# EAGLE design FiltreFSK (EAGLE 6.4)
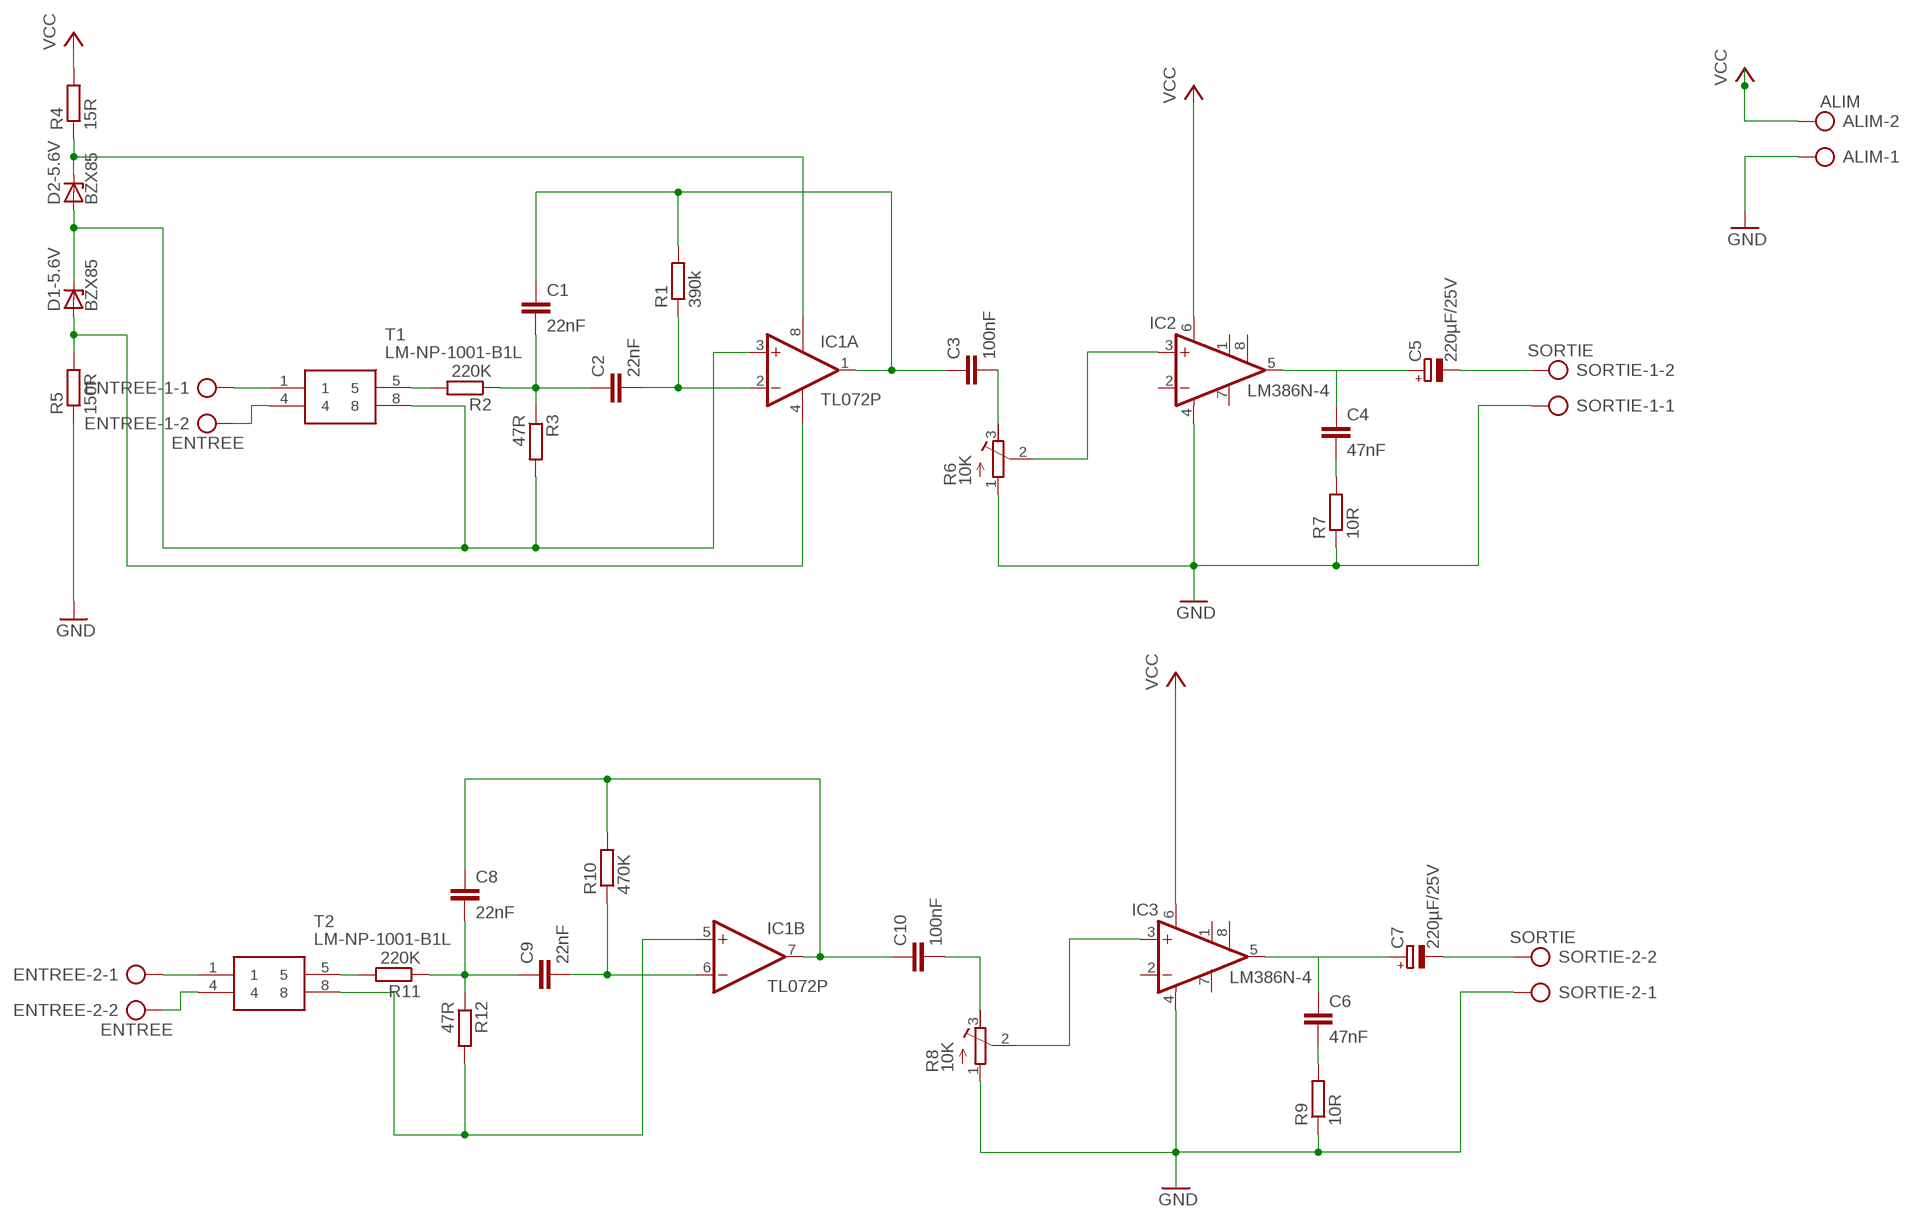
[diagram p0: schematic, sheet 1]

## Parts
ALIM  ALIM  AK500/2-H  [AK500/2-H]
C1  22nF  C-EU050-025X075  [C050-025X075]
C2  22nF  C-EU050-025X075  [C050-025X075]
C3  100nF  C-EU075-042X103  [C075-042X103]
C4  47nF  C-EU050-025X075  [C050-025X075]
C5  220µF/25V  CPOL-EUE3.5-8  [E3,5-8]
C6  47nF  C-EU050-025X075  [C050-025X075]
C7  220µF/25V  CPOL-EUE3.5-8  [E3,5-8]
C8  22nF  C-EU050-025X075  [C050-025X075]
C9  22nF  C-EU050-025X075  [C050-025X075]
C10  100nF  C-EU075-042X103  [C075-042X103]
D1-5.6V  BZX85  [DO41Z10]
D2-5.6V  BZX85  [DO41Z10]
ENTREE-1  ENTREE  AK500/2-H  [AK500/2-H]
ENTREE-2  ENTREE  AK500/2-H  [AK500/2-H]
IC1  TL072P  [DIL08]
IC2  LM386N-4  [DIL08]
IC3  LM386N-4  [DIL08]
R1  390k  R-EU_0207/10  [0207/10]
R2  220K  R-EU_0207/10  [0207/10]
R3  47R  R-EU_0207/10  [0207/10]
R4  15R  R-EU_0207/10  [0207/10]
R5  150R  R-EU_0207/10  [0207/10]
R6  10K  R-TRIMM3339P  [RTRIM3339P]
R7  10R  R-EU_0207/10  [0207/10]
R8  10K  R-TRIMM3339P  [RTRIM3339P]
R9  10R  R-EU_0207/10  [0207/10]
R10  470K  R-EU_0207/10  [0207/10]
R11  220K  R-EU_0207/10  [0207/10]
R12  47R  R-EU_0207/10  [0207/10]
SORTIE-1  SORTIE  AK500/2-H  [AK500/2-H]
SORTIE-2  SORTIE  AK500/2-H  [AK500/2-H]
T1  LM-NP-1001-B1L  [LMNP1001B1L]
T2  LM-NP-1001-B1L  [LMNP1001B1L]

## Nets
GND: ALIM.1 IC2.4(GND) IC3.4(GND) R5.1 R6.1(A) R7.1 R8.1(A) R9.1 SORTIE-1.1 SORTIE-2.1
N$1: D2-5.6V.C IC1.8(P:V+) R4.1
N$2: D1-5.6V.C D2-5.6V.A IC1.3(A:+IN) R3.2 T1.8
N$3: D1-5.6V.A IC1.4(P:V-) R5.2
N$4: C1.2 C2.1 R2.1 R3.1
N$5: C1.1 C3.1 IC1.1(A:OUT) R1.2
N$6: C2.2 IC1.2(A:-IN) R1.1
N$7: ENTREE-1.1 T1.1
N$8: IC2.3(+IN) R6.2(S)
N$9: C4.2 R7.2
N$10: C3.2 R6.3(E)
N$11: ENTREE-1.2 T1.4
N$12: C4.1 C5.+ IC2.5(OUT)
N$13: R2.2 T1.5
N$14: C5.- SORTIE-1.2
N$15: C10.2 R8.3(E)
N$16: IC3.3(+IN) R8.2(S)
N$17: C6.2 R9.2
N$18: C6.1 C7.+ IC3.5(OUT)
N$19: C7.- SORTIE-2.2
N$21: IC1.5(B:+IN) R12.2 T2.8
N$23: C8.2 C9.1 R11.1 R12.1
N$24: C8.1 C10.1 IC1.7(B:OUT) R10.2
N$25: C9.2 IC1.6(B:-IN) R10.1
N$26: ENTREE-2.1 T2.1
N$27: ENTREE-2.2 T2.4
N$28: R11.2 T2.5
VCC: ALIM.2 IC2.6(VS) IC3.6(VS) R4.2
Unconnected: IC2.1(GAIN) IC2.2(-IN) IC2.7(BYPASS) IC2.8(GAIN) IC3.1(GAIN) IC3.2(-IN) IC3.7(BYPASS) IC3.8(GAIN)

## Library data of the parts
ALIM ENTREE-1 ENTREE-2 SORTIE-1 SORTIE-2 = con-ptr500:AK500/2-H: CONNECTOR Aug. 2004 / PTR Meßtechnik: Die Bezeichnung der Serie AK505 wurde geändert. Es handelt sich hierbei um AK500 in horizontaler Ausführung.; OC_FARNELL: unknown; OC_NEWARK: unknown
C1-C4 C6 C8-C10 = rcl:C-EU: CAPACITOR, European symbol
C5 C7 = rcl:CPOL-EU: POLARIZED CAPACITOR, European symbol
D1-5.6V D2-5.6V = diode:BZX85: Z DIODE
IC1 = linear:TL072: OP AMP
IC2 IC3 = linear:LM386?-*: Low Voltage Audio Power Amplifier Source: http://cache.national.com/ds/LM/LM386.pdf
R1-R5 R7 R9-R12 = rcl:R-EU_: RESISTOR, European symbol
R6 R8 = rcl:R-TRIMM: Trimm resistor
T1 T2 = LM-NP-1001-B1L:LM-NP-1001-B1L: BOURNS - LM-NP-1001-B1L - TRANSFORMER, LINE-MATCHING 1:1, 2.8H Source: Datasheet <https://www.bourns.com/pdfs/LMNPLP.pdf>; ALLIED_NUMBER: 70154707; ALLIED_PRICE-STOCK: https://www.alliedelec.com/bourns-lm-np-1001-b1l/70154707/; DESCRIPTION: BOURNS - LM-NP-1001-B1L - TRANSFORMER, LINE-MATCHING 1:1, 2.8H; HEIGHT: 12mm; MANUFACTURER_NAME: Bourns; MANUFACTURER_PART_NUMBER: LM-NP-1001-B1L; MOUSER_PART_NUMBER: 652-LM-NP-1001-B1L; MOUSER_PRICE-STOCK: https://www.mouser.com/Search/Refine.aspx?Keyword=652-LM-NP-1001-B1L; RS_PART_NUMBER: 1740620; RS_PRICE-STOCK: http://uk.rs-online.com/web/p/products/1740620

## Board
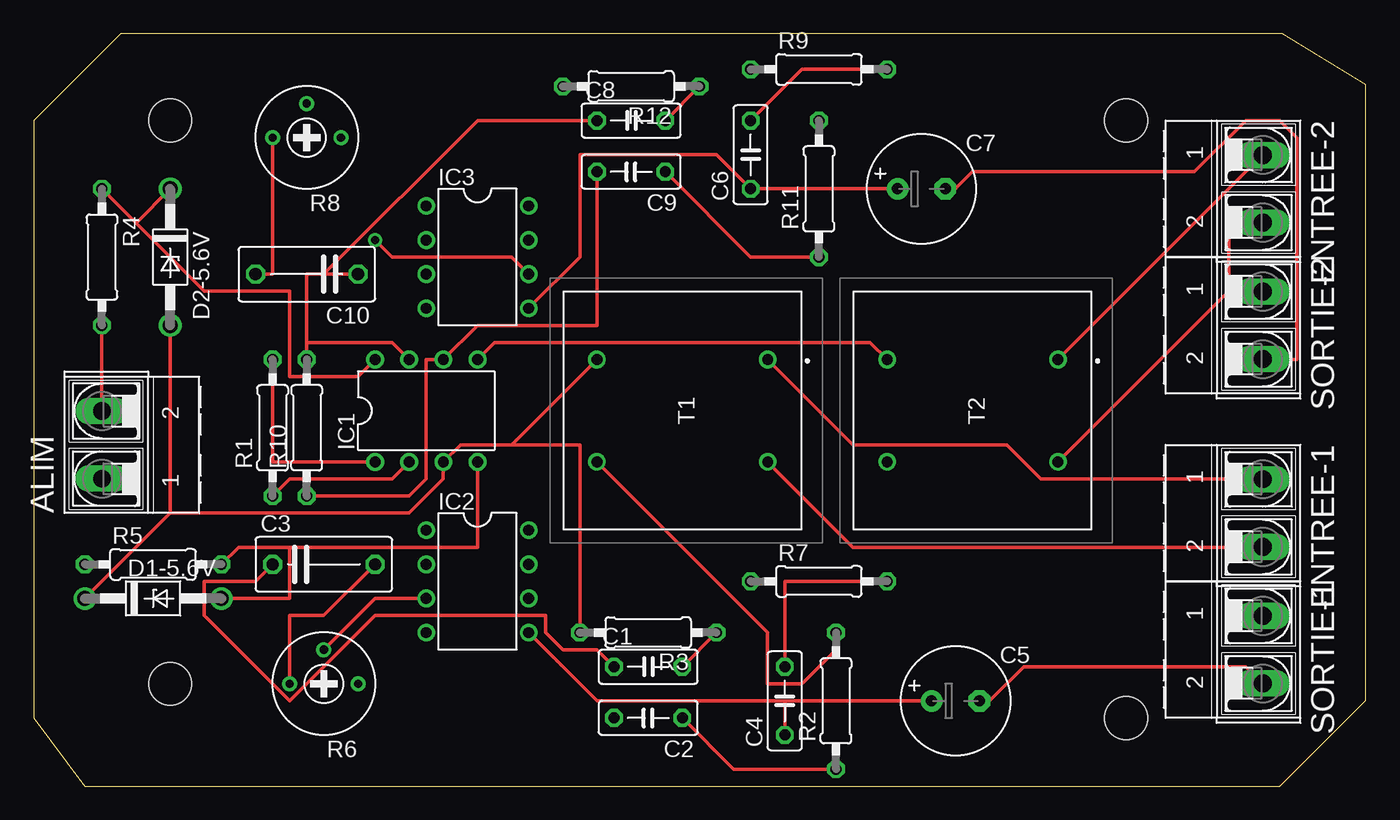
[diagram p1: board, top side]
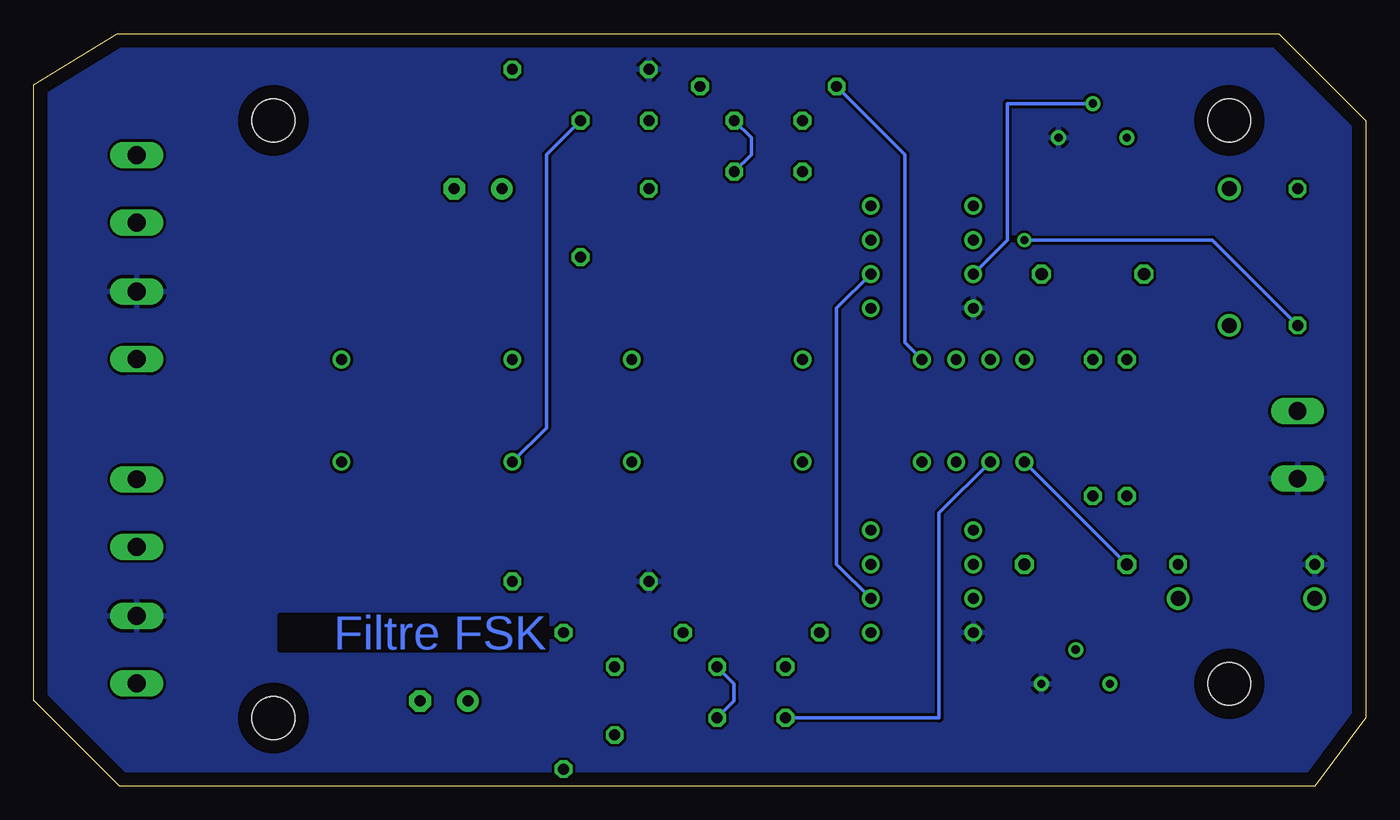
[diagram p2: board, bottom side, seen from below]

Size 99.11 x 56 mm. Coordinates in mm from the lower left corner, seen from the top.
Outline: 99.06,6.35 92.71,0 3.81,0 0,5.08 0,49.53 6.47,56 92.88,56 99.11,52.19 99.11,6.35
Copper layers (1*16): Top 0.035mm / dielectric 1.5mm / Bottom 0.035mm
Design rules "default": minimum track width 10mil, minimum drill 24mil, track to track 8mil, track to pad 8mil, pad to pad 8mil, via to via 8mil, smd to smd 8mil, copper to edge 40mil, drill to drill 8mil, minimum pad ring 10mil, minimum via ring 8mil, stop-mask expansion 4mil, vias tented up to drill 0mil, thermal gap 10mil
Holes 3.2 mm at 10.16,7.62 81.28,5.08 81.28,49.53 10.16,49.53

### Footprints (pad centres in the part's own frame; a part is rotated, then mirrored left to right if it is on the bottom)
AK500/2-H = drill 1.321 long: 1 -2.515,0; 2 2.515,0
C050-025X075 = drill 0.813 octagon: 1 -2.54,0; 2 2.54,0
C075-042X103 = drill 0.914 octagon: 1 -3.81,0; 2 3.81,0
E3,5-8 = drill 0.813 pad 1.6: + -1.778,0 | drill 0.813 pad 1.6 octagon: - 1.778,0
DO41Z10 = drill 1.118: A 5.08,0; C -5.08,0
DIL08 = drill 0.813 pad 1.27: 1 -3.81,-3.81; 2 -1.27,-3.81; 3 1.27,-3.81; 4 3.81,-3.81; 5 3.81,3.81; 6 1.27,3.81; 7 -1.27,3.81; 8 -3.81,3.81
0207/10 = drill 0.813 octagon: 1 -5.08,0; 2 5.08,0
RTRIM3339P = drill 0.61: 1 -2.54,0; 2 0,-2.54; 3 2.54,0
LMNP1001B1L = drill 0.8 pad 1.3: 1 3.81,-6.35; 4 -3.81,-6.35; 5 -3.81,6.35; 8 3.81,6.35

### Placement (x,y rotation side)
ALIM  5.08,25.4 90 top
C1  45.72,8.89 0 top
C2  45.72,5.08 180 top
C3  21.59,16.51 0 top
C4  55.88,6.35 90 top
C5  68.58,6.35 0 top
C6  53.34,46.99 90 top
C7  66.04,44.45 0 top
C8  44.45,49.53 0 top
C9  44.45,45.72 180 top
C10  20.32,38.1 180 top
D1-5.6V  8.89,13.97 0 top
D2-5.6V  10.16,39.37 270 top
ENTREE-1  91.44,20.32 270 top
ENTREE-2  91.44,44.45 270 top
IC1  29.21,27.94 0 top
IC2  33.02,15.24 270 top
IC3  33.02,39.37 270 top
R1  17.78,26.67 90 top
R2  59.69,6.35 90 top
R3  45.72,11.43 180 top
R4  5.08,39.37 270 top
R5  8.89,16.51 0 top
R6  21.59,7.62 180 top
R7  58.42,15.24 0 top
R8  20.32,48.26 180 top
R9  58.42,53.34 0 top
R10  20.32,26.67 90 top
R11  58.42,44.45 90 top
R12  44.45,52.07 180 top
SORTIE-1  91.44,10.16 270 top
SORTIE-2  91.44,34.29 270 top
T1  48.26,27.94 90 top
T2  69.85,27.94 90 top

### Tracks (layer width: path | path; a pad name or v marks a point on that pad's centre or on a via)
GND
  pour Bottom: 0,56 99.11,56 99.11,0 0,0
N$1
  Top 0.254: IC1.8 24.13,30.48 19.05,30.48 19.05,36.83 12.7,36.83 7.62,41.91 | R4.1 7.62,41.91 | 7.62,41.91 D2-5.6V.C
N$2
  Top 0.254: 10.16,20.32 D1-5.6V.C | D2-5.6V.A 10.16,20.32 | 35.56,25.4 T1.8 | 35.56,25.4 31.75,25.4 IC1.3 30.48,22.86 27.94,20.32 10.16,20.32 | R3.2 40.64,25.4 35.56,25.4
N$3
  Top 0.254: R5.2 15.24,17.78 19.05,17.78 | 19.05,17.78 19.05,13.97 D1-5.6V.A | IC1.4 33.02,17.78 19.05,17.78
N$4
  Top 0.254: R3.1 C1.2 | C2.1 52.07,1.27 R2.1
  Bottom 0.254: C1.2 46.99,7.62 46.99,6.35 C2.1
N$5
  Top 0.254: R1.2 17.78,24.13 IC1.1 | C1.1 41.91,10.16 39.37,10.16 38.1,11.43 38.1,12.7 25.4,12.7 19.05,6.35 12.7,12.7 12.7,15.24 16.51,15.24 C3.1
  Bottom 0.254: C3.1 IC1.1
N$6
  Top 0.254: R1.1 19.05,22.86 26.67,22.86 IC1.2
  Bottom 0.254: C2.2 31.75,5.08 31.75,20.32 IC1.2
N$7
  Top 0.254: T1.1 60.96,25.4 72.39,25.4 74.93,22.86 91.44,22.86 ENTREE-1.1
N$8
  Top 0.254: R6.2 25.4,13.97 IC2.3
N$9
  Top 0.254: C4.2 55.88,15.24 R7.2
N$10
  Top 0.254: R6.3 19.05,12.7 21.59,12.7 C3.2
N$11
  Top 0.254: T1.4 60.96,17.78 91.44,17.78 ENTREE-1.2
N$12
  Top 0.254: IC2.5 41.91,6.35 55.88,6.35 | C5.+ 55.88,6.35 | 55.88,6.35 C4.1
N$13
  Top 0.254: T1.5 54.61,11.43 54.61,7.62 57.15,7.62 59.69,10.16 R2.2
N$14
  Top 0.254: C5.- 71.12,6.35 73.66,8.89 90.17,8.89 91.44,7.62 SORTIE-1.2
N$15
  Top 0.254: R8.3 17.78,38.1 C10.2
N$16
  Bottom 0.254: R8.2 26.67,50.8 26.67,40.64 IC3.3
N$17
  Top 0.254: C6.2 57.15,53.34 R9.2
N$18
  Top 0.254: IC3.5 40.64,39.37 40.64,46.99 50.8,46.99 C6.1 C7.+
N$19
  Top 0.254: C7.- 68.58,44.45 69.85,45.72 86.36,45.72 90.17,49.53 92.71,49.53 93.98,48.26 93.98,31.75 91.44,31.75 SORTIE-2.2
N$21
  Top 0.254: T2.8 62.23,33.02 34.29,33.02 IC1.5
  Bottom 0.254: R12.2 34.29,46.99 34.29,33.02 IC1.5
N$23
  Top 0.254: R12.1 C8.2 | C9.1 53.34,39.37 R11.1
  Bottom 0.254: C8.2 45.72,48.26 45.72,46.99 C9.1
N$24
  Top 0.254: 20.32,33.02 20.32,38.1 21.59,38.1 | 20.32,33.02 R10.2 | C10.1 21.59,38.1 | IC1.7 26.67,33.02 20.32,33.02 | C8.1 33.02,49.53 21.59,38.1
N$25
  Top 0.254: R10.1 27.94,21.59 29.21,22.86 29.21,31.75 IC1.6 33.02,34.29 41.91,34.29 C9.2
N$26
  Top 0.254: T2.1 91.44,46.99 ENTREE-2.1
N$27
  Top 0.254: T2.4 88.9,36.83 88.9,41.91 91.44,41.91 ENTREE-2.2
N$28
  Bottom 0.254: T2.5 60.96,26.67 60.96,46.99 R11.2
VCC  (via drill 0.61)
  Top 0.254: ALIM.2 R4.2 | v25.4,40.64 26.67,39.37 35.56,39.37 IC3.6
  Bottom 0.254: IC2.6 39.37,16.51 39.37,35.56 IC3.6 | R4.2 11.43,40.64 v25.4,40.64

### Text on the board
Bottom: Filtre FSK